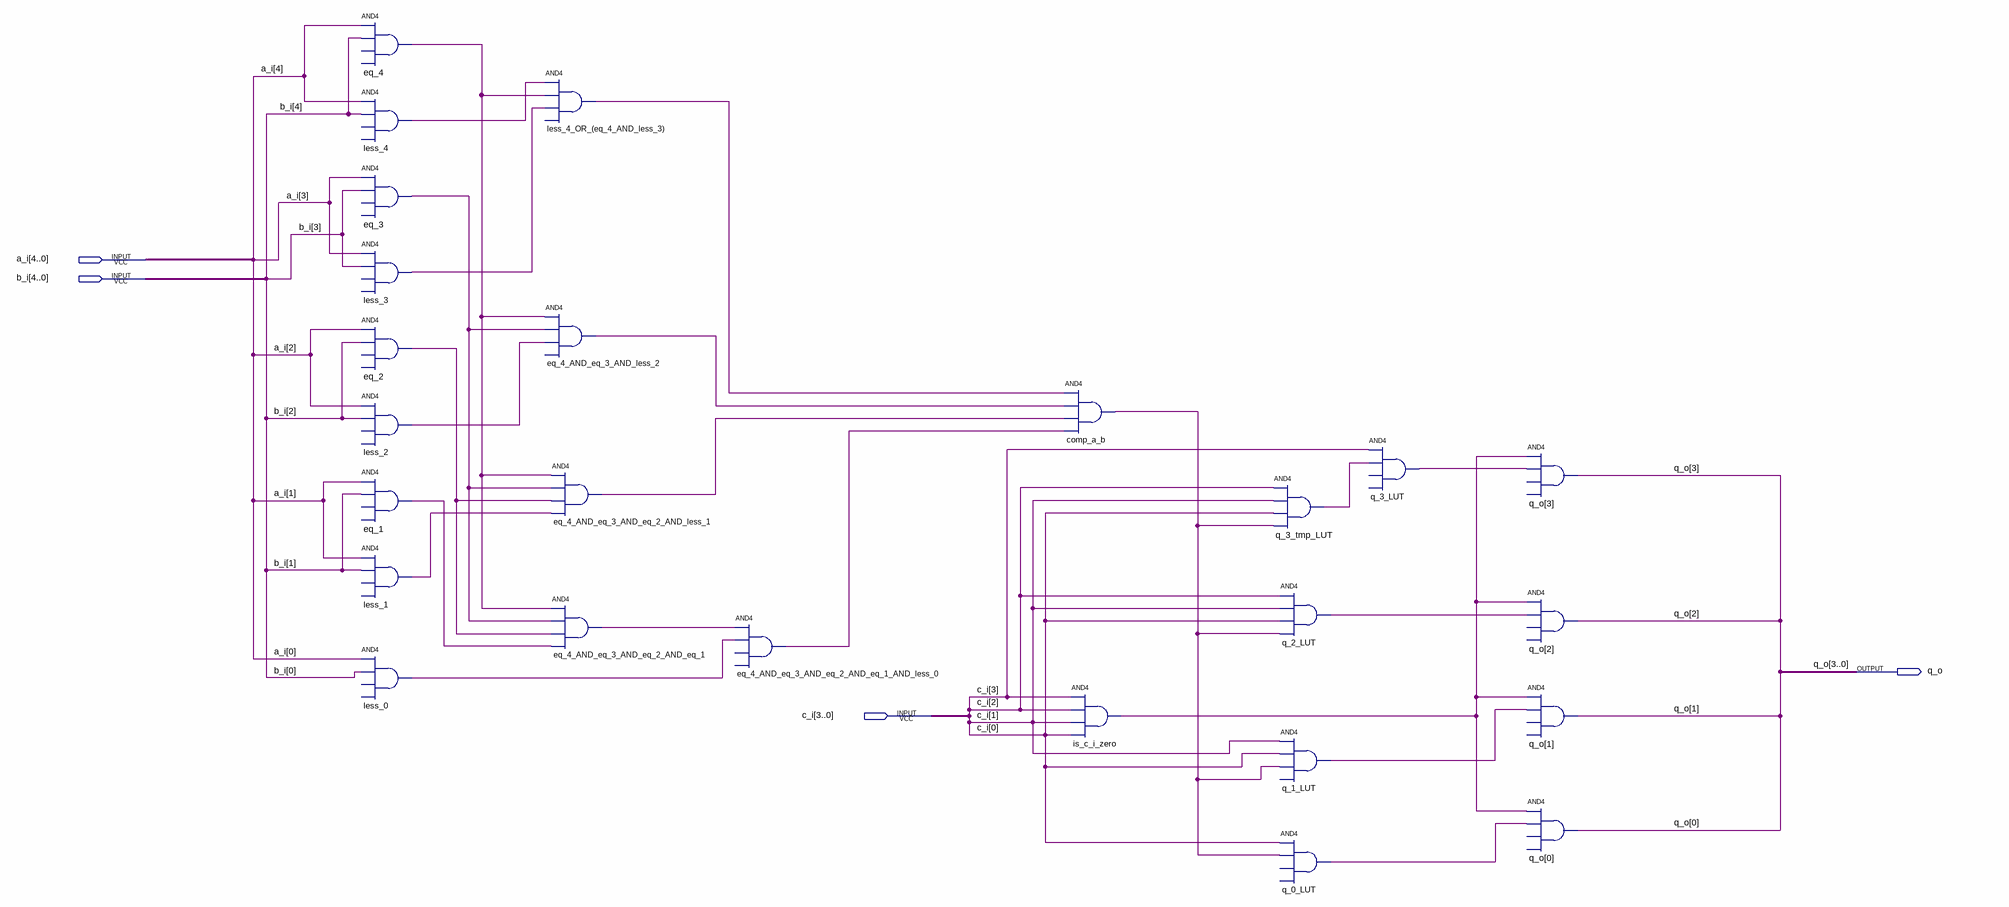
[diagram p0: schematic sheet]
// Quartus schematic task_2.bdf as structural Verilog: 25 symbols, 4 pins
module task_2 (
  input  [4:0] a_i,
  input  [4:0] b_i,
  input  [3:0] c_i,
  output q_o
);

  wire comp_a_b_out, eq_1_out, eq_2_out, eq_3_out, eq_4_AND_eq_3_AND_eq_2_AND_eq_1_AND_less_0_out,
       eq_4_AND_eq_3_AND_eq_2_AND_eq_1_out, eq_4_AND_eq_3_AND_eq_2_AND_less_1_out,
       eq_4_AND_eq_3_AND_less_2_out, eq_4_out, is_c_i_zero_out, less_0_out, less_1_out, less_2_out,
       less_3_out, less_4_OR__eq_4_AND_less_3__out, less_4_out, q_0_LUT_out, q_1_LUT_out, q_2_LUT_out,
       q_3_LUT_out, q_3_tmp_LUT_out;
  wire [3:1] q_o_bus;

  and eq_4 (eq_4_out, a_i[4], b_i[4]);  // open: IN3, IN4
  and less_4 (less_4_out, a_i[4], b_i[4]);  // open: IN3, IN4
  and eq_3 (eq_3_out, a_i[3], b_i[3]);  // open: IN3, IN4
  and less_3 (less_3_out, a_i[3], b_i[3]);  // open: IN3, IN4
  and eq_2 (eq_2_out, a_i[2], b_i[2]);  // open: IN3, IN4
  and less_2 (less_2_out, a_i[2], b_i[2]);  // open: IN3, IN4
  and eq_1 (eq_1_out, a_i[2], b_i[2]);  // open: IN3, IN4
  and less_1 (less_1_out, a_i[2], b_i[2]);  // open: IN3, IN4
  and less_0 (less_0_out, a_i[2], b_i[2]);  // open: IN3, IN4
  and \less_4_OR_(eq_4_AND_less_3)  (less_4_OR__eq_4_AND_less_3__out, less_4_out, eq_4_out, less_3_out);  // open: IN4
  and eq_4_AND_eq_3_AND_less_2 (eq_4_AND_eq_3_AND_less_2_out, eq_4_out, eq_3_out, less_2_out);  // open: IN4
  and eq_4_AND_eq_3_AND_eq_2_AND_less_1 (eq_4_AND_eq_3_AND_eq_2_AND_less_1_out, eq_4_out, eq_3_out, eq_2_out, less_1_out);
  and eq_4_AND_eq_3_AND_eq_2_AND_eq_1 (eq_4_AND_eq_3_AND_eq_2_AND_eq_1_out, eq_4_out, eq_3_out, eq_2_out, eq_1_out);
  and eq_4_AND_eq_3_AND_eq_2_AND_eq_1_AND_less_0 (eq_4_AND_eq_3_AND_eq_2_AND_eq_1_AND_less_0_out, eq_4_AND_eq_3_AND_eq_2_AND_eq_1_out, less_0_out);  // open: IN3, IN4
  and comp_a_b (comp_a_b_out, less_4_OR__eq_4_AND_less_3__out, eq_4_AND_eq_3_AND_less_2_out, eq_4_AND_eq_3_AND_eq_2_AND_less_1_out, eq_4_AND_eq_3_AND_eq_2_AND_eq_1_AND_less_0_out);
  and is_c_i_zero (is_c_i_zero_out, c_i[3], c_i[3], c_i[1], c_i[1]);
  and q_3_tmp_LUT (q_3_tmp_LUT_out, c_i[3], c_i[1], c_i[1], comp_a_b_out);
  and q_2_LUT (q_2_LUT_out, c_i[3], c_i[1], c_i[1], comp_a_b_out);
  and q_1_LUT (q_1_LUT_out, c_i[1], c_i[1], comp_a_b_out);  // open: IN4
  and q_0_LUT (q_0_LUT_out, c_i[1], comp_a_b_out);  // open: IN3, IN4
  and q_3_LUT (q_3_LUT_out, c_i[3], q_3_tmp_LUT_out);  // open: IN3, IN4
  and \q_o[3]  (q_o_bus[3], is_c_i_zero_out, q_3_LUT_out);  // open: IN3, IN4
  and \q_o[2]  (q_o_bus[3], is_c_i_zero_out, q_2_LUT_out);  // open: IN3, IN4
  and \q_o[1]  (q_o_bus[1], is_c_i_zero_out, q_1_LUT_out);  // open: IN3, IN4
  and \q_o[0]  (q_o_bus[1], is_c_i_zero_out, q_0_LUT_out);  // open: IN3, IN4

  assign a_i[1:0] = {2{a_i[2]}};
  assign b_i[1:0] = {2{b_i[2]}};
  assign {c_i[2], c_i[0]} = {c_i[3], c_i[1]};

  // Other names for the same wires on the sheet: q_o (some bits) = {q_o_bus[3], q_o_bus[1]}
endmodule
